# EAGLE design nanopositioner (EAGLE 9.6.2)

## Sheet 1 of 2
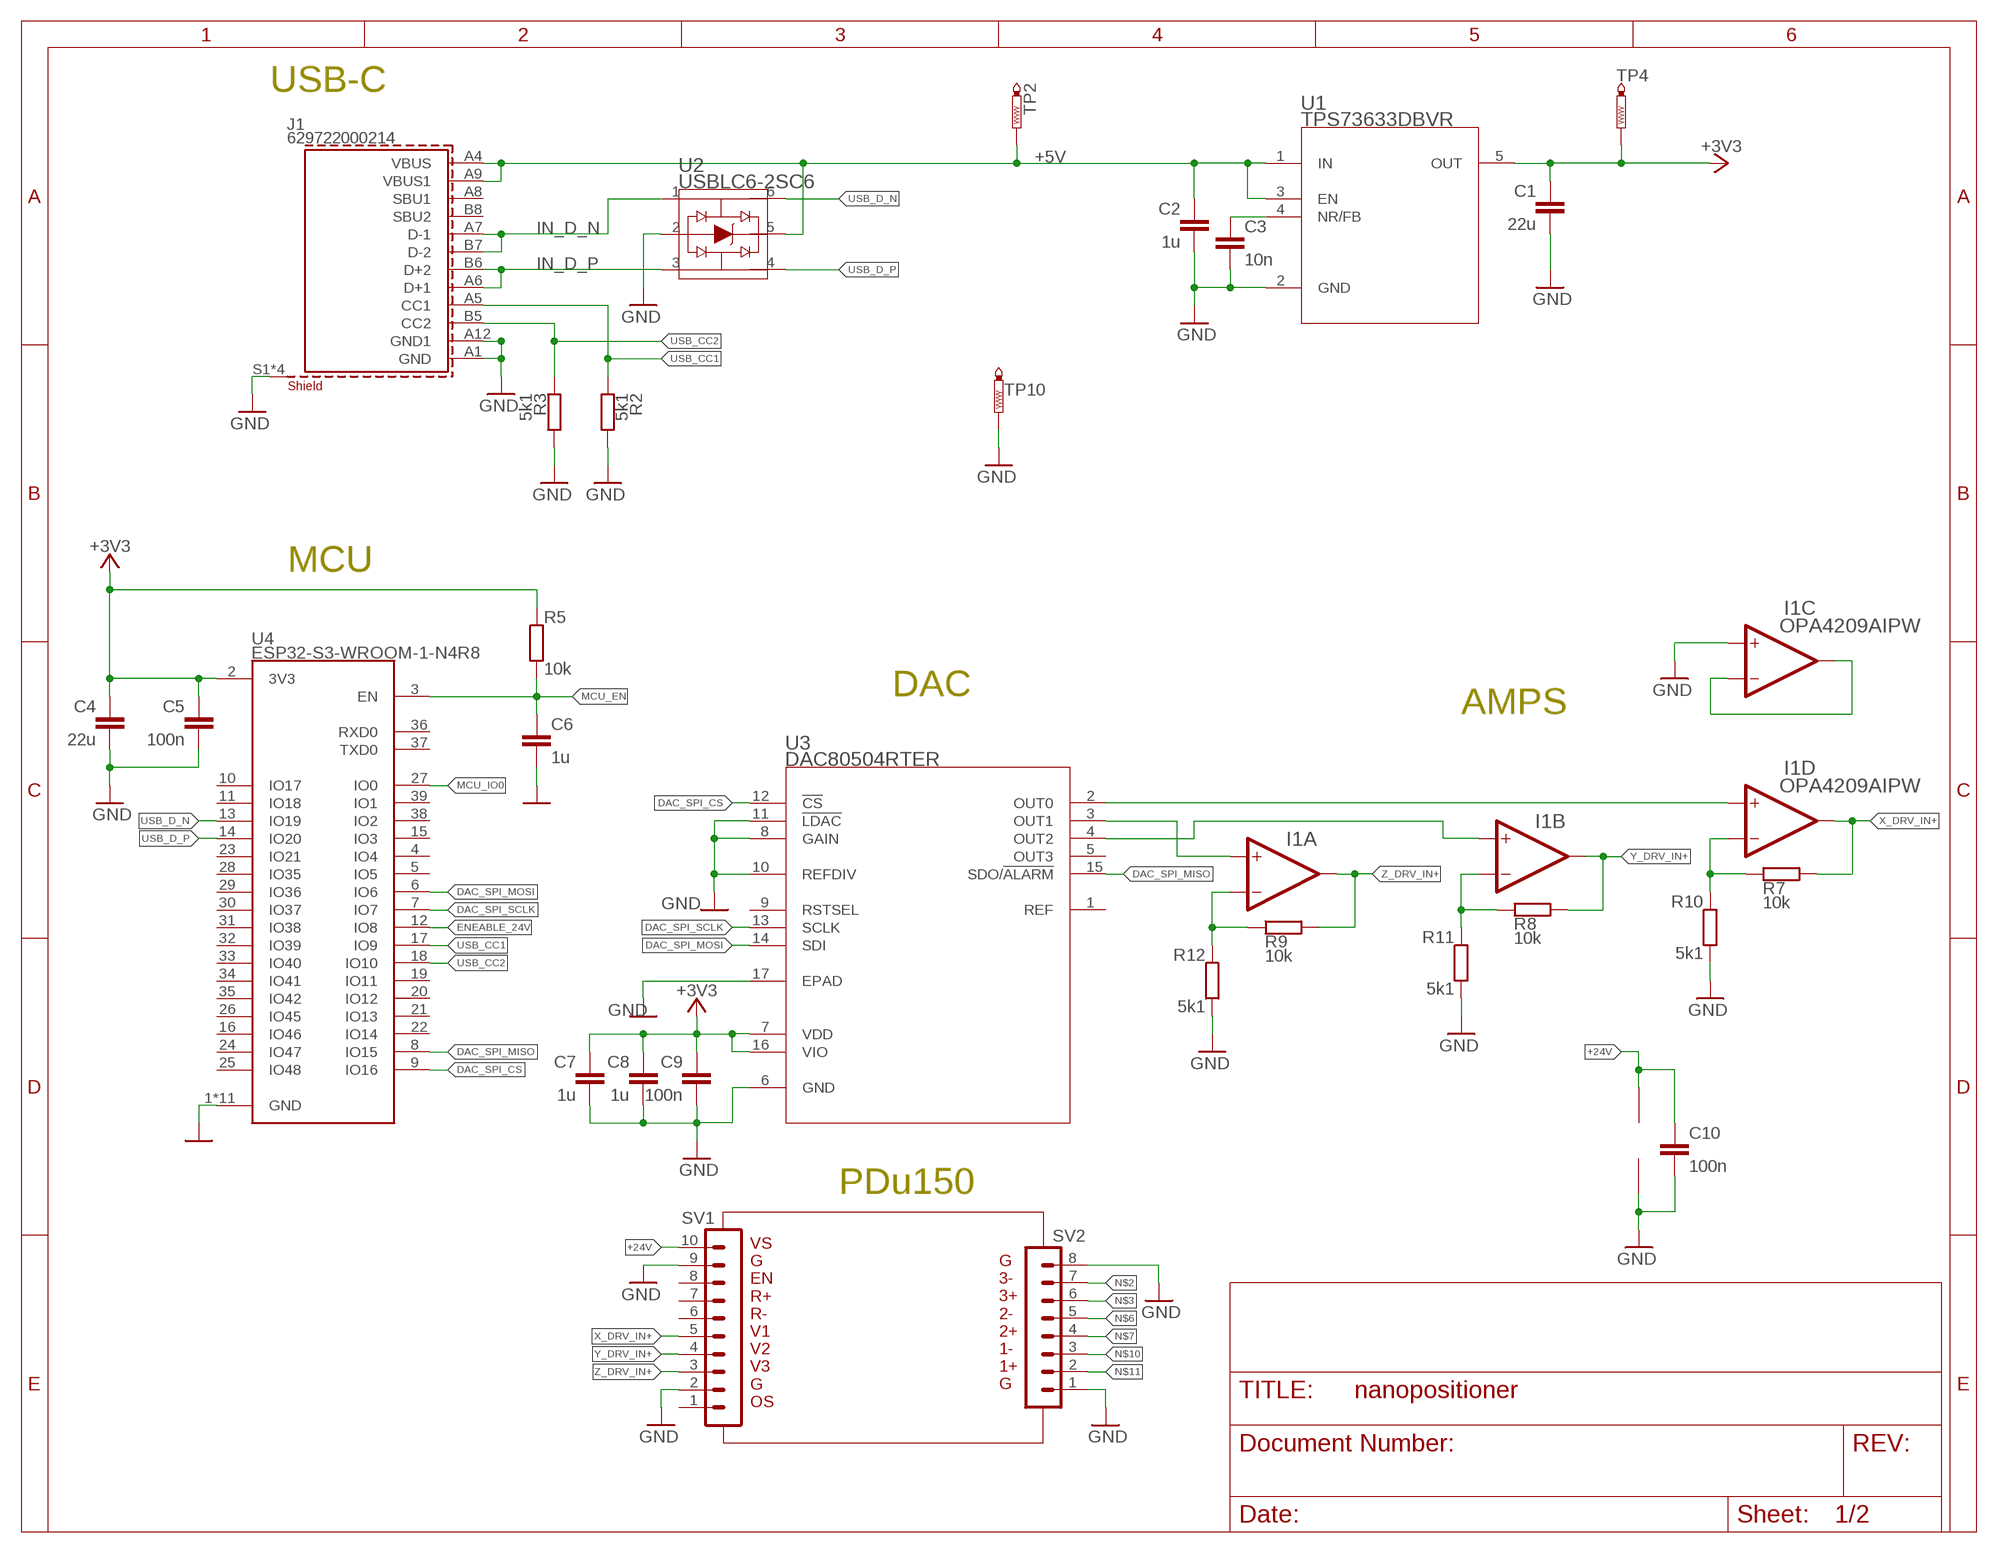
[diagram p0: schematic, sheet 1]

### Parts
C1  22u  C-EUC0603  [C0603]
C2  1u  C-EUC0402  [C0402]
C3  10n  C-EUC0402  [C0402]
C4  22u  C-EUC0603  [C0603]
C5  100n  C-EUC0402  [C0402]
C6  1u  C-EUC0402  [C0402]
C7  1u  C-EUC0402  [C0402]
C8  1u  C-EUC0402  [C0402]
C9  100n  C-EUC0402  [C0402]
C10  100n  C-EUC0402  [C0402]
I1  OPA4209AIPW  [PW14]
J1  629722000214  [629722000214]
R2  5k1  R-EU_R0402  [R0402]
R3  5k1  R-EU_R0402  [R0402]
R5  10k  R-EU_R0402  [R0402]
R7  10k  R-EU_R0402  [R0402]
R8  10k  R-EU_R0402  [R0402]
R9  10k  R-EU_R0402  [R0402]
R10  5k1  R-EU_R0402  [R0402]
R11  5k1  R-EU_R0402  [R0402]
R12  5k1  R-EU_R0402  [R0402]
SV1  MA10-1  [MA10-1]
SV2  MA08-1  [MA08-1]
TP2  PTR1PAD1-13  [P1-13]
TP4  PTR1PAD1-13  [P1-13]
TP10  PTR1PAD1-13  [P1-13]
U1  TPS73633DBVR  [DBV5]
U2  USBLC6-2SC6  [SOT23-6L_STM]
U3  DAC80504RTER  [RTE16_TEX]
U4  ESP32-S3-WROOM-1-N4R8  [XCVR_ESP32S3WROOM1N8R8]

### Nets
+3V3: C1.1 C4.1 C5.1 C7.1 C8.1 C9.1 R5.1 TP4.TP U1.5(OUT) U3.7(VDD) U3.16(VIO) U4.2(3V3)
+5V: C2.2 J1.A4(VBUS) J1.A9(VBUS1) TP2.TP U1.1(IN) U1.3(EN) U2.5 ; also sheet 2
+24V: C10.1 I1.4 SV1.10 ; also sheet 2
DAC_SPI_CS: U3.12(!CS) U4.9(IO16)
DAC_SPI_MISO: U3.15(SDO/!ALARM) U4.8(IO15)
DAC_SPI_MOSI: U3.14(SDI) U4.6(IO6)
DAC_SPI_SCLK: U3.13(SCLK) U4.7(IO7)
ENEABLE_24V: U4.12(IO8) ; also sheet 2
GND: C1.2 C2.1 C3.2 C4.2 C5.2 C6.1 C7.2 C8.2 C9.2 C10.2 I1.10(C:INA+) I1.11 J1.A1(GND) J1.A12(GND1) J1.S1(SHIELD) J1.S2(SHIELD) J1.S3(SHIELD) J1.S4(SHIELD) R2.1 R3.2 R10.2 R11.2 R12.2 SV1.2 SV1.9 SV2.1 SV2.8 TP10.TP U1.2(GND) U2.2 U3.6(GND) U3.8(GAIN) U3.10(REFDIV) U3.11(!LDAC) U3.17(EPAD) U4.1(GND) U4.40(GND) U4.41_1(GND) U4.41_2(GND) U4.41_3(GND) U4.41_4(GND) U4.41_5(GND) U4.41_6(GND) U4.41_7(GND) U4.41_8(GND) U4.41_9(GND) ; also sheet 2
IN_D_N [Diff pair]: J1.A7(D-1) J1.B7(D-2) U2.1
IN_D_P [Diff pair]: J1.A6(D+1) J1.B6(D+2) U2.3
MCU_EN: C6.2 R5.2 U4.3(EN)
MCU_IO0: U4.27(IO0)
N$1: I1.13(D:INA-) R7.1 R10.1
N$2: SV2.7
N$3: SV2.6
N$6: SV2.5
N$7: SV2.4
N$9: C3.1 U1.4(NR/FB)
N$10: SV2.3
N$11: SV2.2
N$12: I1.3(A:INA+) U3.3(OUT1)
N$13: I1.6(B:INA-) R8.1 R11.1
N$14: I1.5(B:INA+) U3.4(OUT2)
N$15: I1.2(A:INA-) R9.1 R12.1
N$16: I1.12(D:INA+) U3.2(OUT0)
N$17: I1.8(C:OUTA) I1.9(C:INA-)
USB_CC1: J1.A5(CC1) R2.2 U4.17(IO9)
USB_CC2: J1.B5(CC2) R3.1 U4.18(IO10)
USB_D_N [Diff pair]: U2.6 U4.13(IO19)
USB_D_P [Diff pair]: U2.4 U4.14(IO20)
X_DRV_IN+: I1.14(D:OUTA) R7.2 SV1.5
Y_DRV_IN+: I1.7(B:OUTA) R8.2 SV1.4
Z_DRV_IN+: I1.1(A:OUTA) R9.2 SV1.3
Unconnected: J1.A8(SBU1) J1.B8(SBU2) SV1.1 SV1.6 SV1.7 SV1.8 U3.1(REF) U3.5(OUT3) U3.9(RSTSEL) U4.4(IO4) U4.5(IO5) U4.10(IO17) U4.11(IO18) U4.15(IO3) U4.16(IO46) U4.19(IO11) U4.20(IO12) U4.21(IO13) U4.22(IO14) U4.23(IO21) U4.24(IO47) U4.25(IO48) U4.26(IO45) U4.28(IO35) U4.29(IO36) U4.30(IO37) U4.31(IO38) U4.32(IO39) U4.33(IO40) U4.34(IO41) U4.35(IO42) U4.36(RXD0) U4.37(TXD0) U4.38(IO2) U4.39(IO1)

### Notes on the sheet
- USB-C
- MCU
- DAC
- AMPS
- PDu150
- G
  3-
  3+
  2-
  2+
  1-
  1+
  G
- VS
  G
  EN
  R+
  R-
  V1
  V2
  V3
  G
  OS

## Sheet 2 of 2
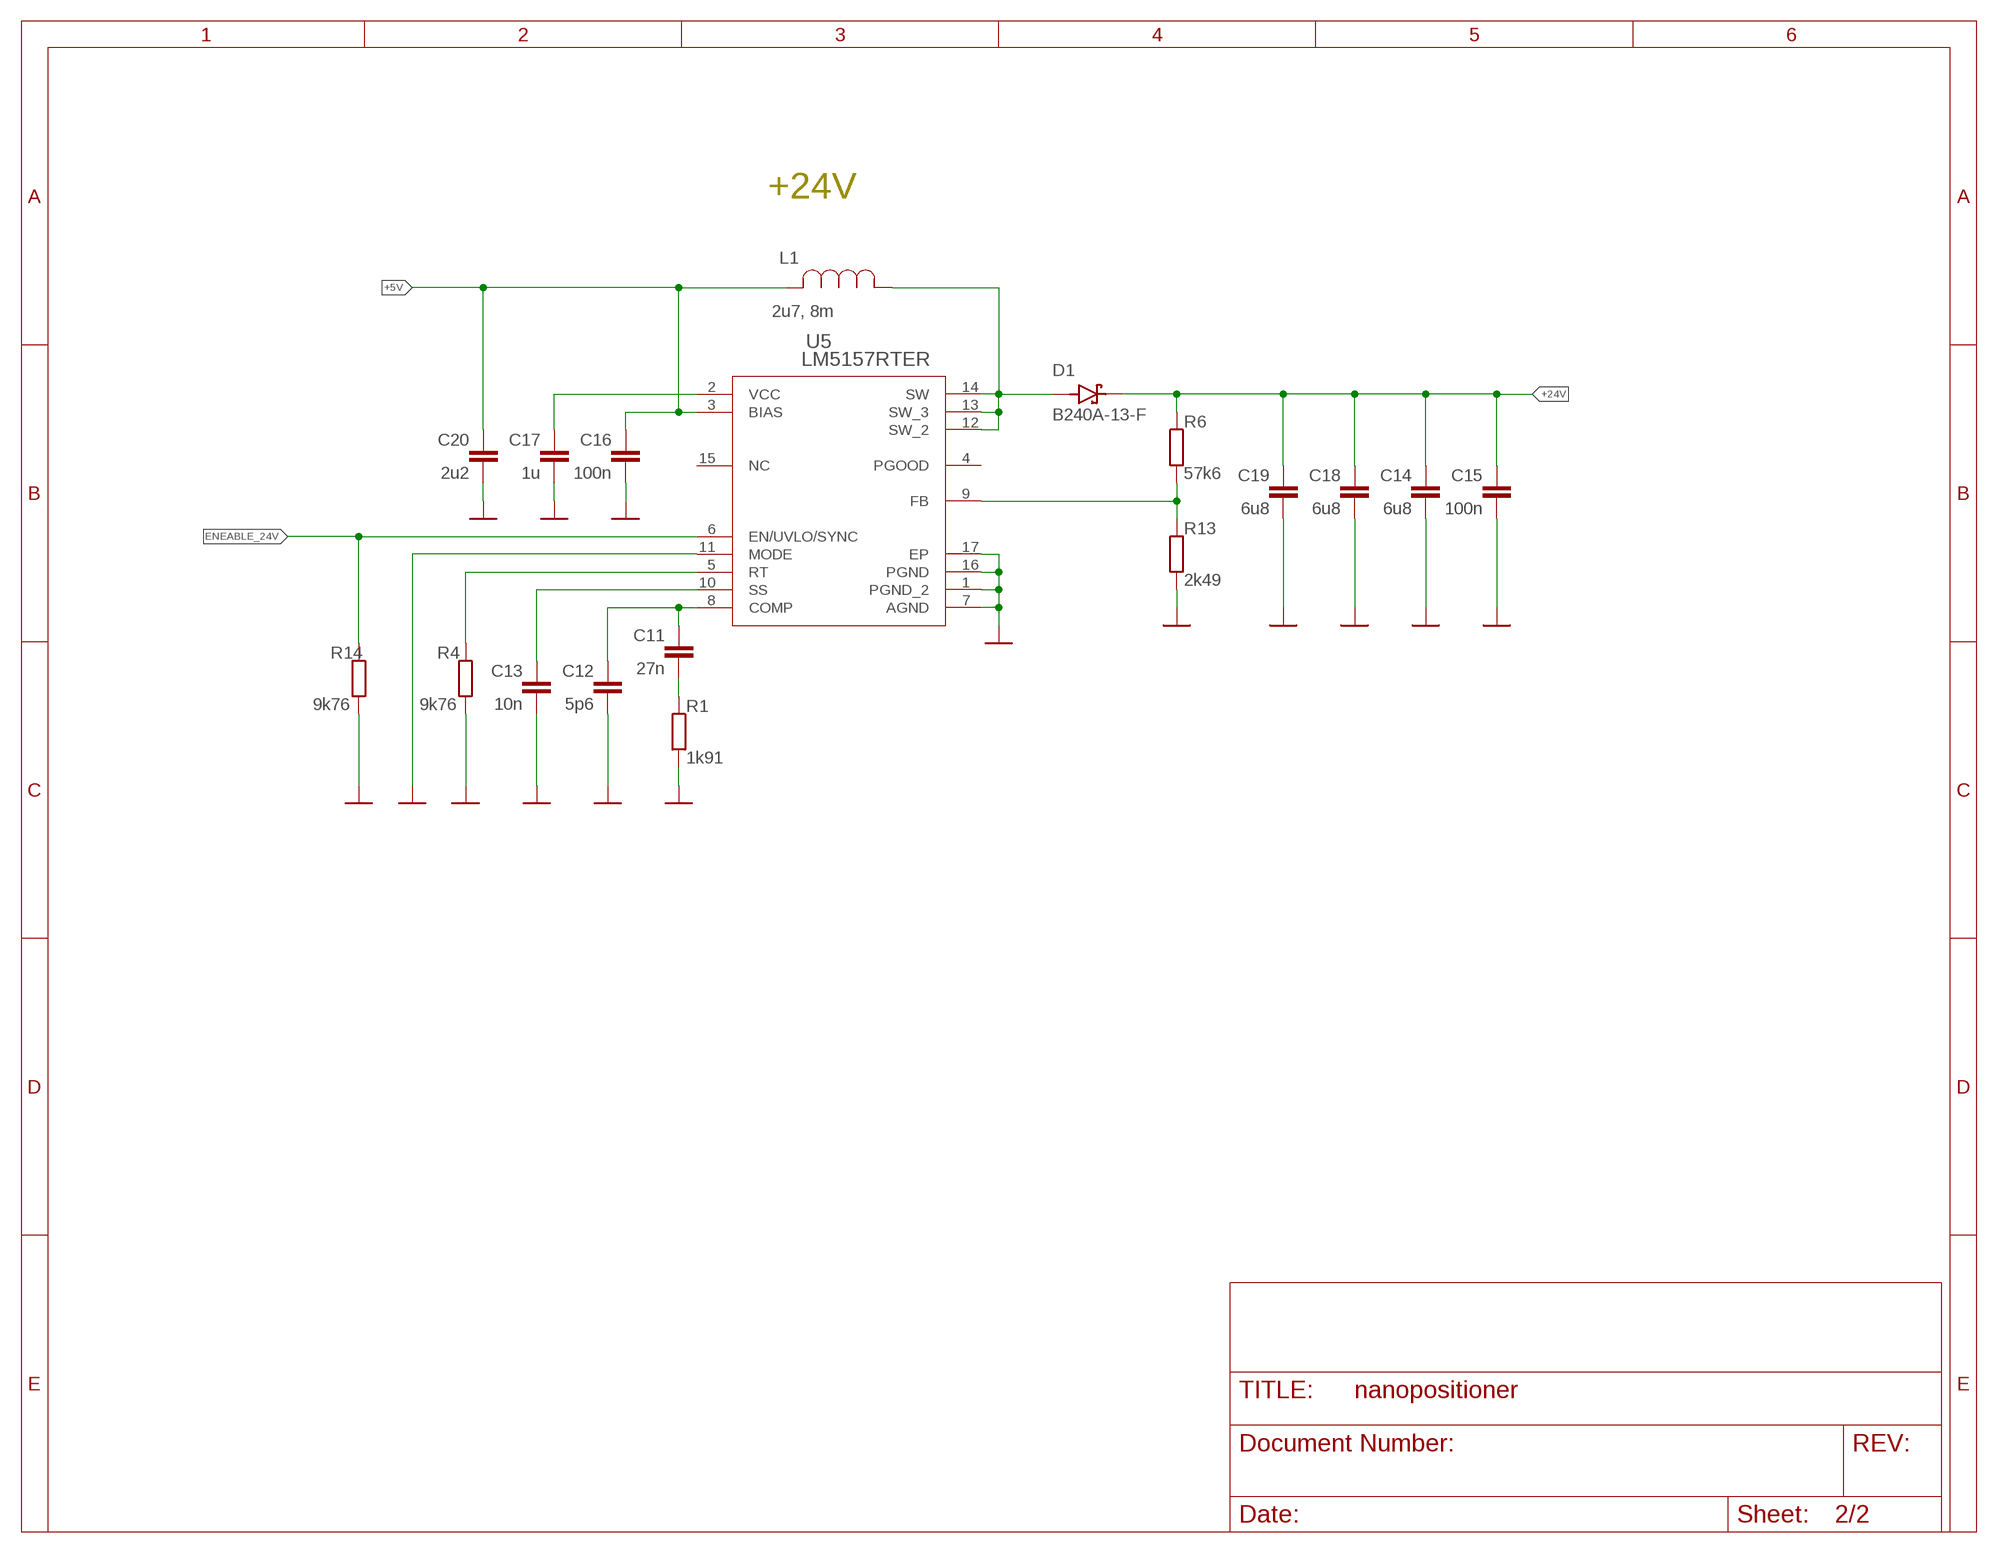
[diagram p1: schematic, sheet 2]

### Parts
C11  27n  C-EUC0402  [C0402]
C12  5p6  C-EUC0402  [C0402]
C13  10n  C-EUC0402  [C0402]
C14  6u8  C-EUC1206  [C1206]
C15  100n  C-EUC0603  [C0603]
C16  100n  C-EUC0603  [C0603]
C17  1u  C-EUC0402  [C0402]
C18  6u8  C-EUC1206  [C1206]
C19  6u8  C-EUC1206  [C1206]
C20  2u2  C-EUC0805  [C0805]
D1  B240A-13-F  [DIOM5226X230N]
L1  2u7, 8m  SDR1307-2R7ML  [IND_BOURNS_SDR1307]
R1  1k91  R-EU_R0402  [R0402]
R4  9k76  R-EU_R0402  [R0402]
R6  57k6  R-EU_R0402  [R0402]
R13  2k49  R-EU_R0402  [R0402]
R14  9k76  R-EU_R0402  [R0402]
U5  LM5157RTER  [QFN_57RTER_TEX]

### Nets
+5V: C16.2 C20.2 L1.2 U5.3(BIAS) ; also sheet 1
+24V: C14.2 C15.2 C18.2 C19.2 D1.C(K) R6.1 ; also sheet 1
ENEABLE_24V: R14.1 U5.6(EN/UVLO/SYNC) ; also sheet 1
GND: C12.1 C13.1 C14.1 C15.1 C16.1 C17.1 C18.1 C19.1 C20.1 R1.2 R4.2 R13.2 R14.2 U5.1(PGND_2) U5.7(AGND) U5.11(MODE) U5.16(PGND) U5.17(EP) ; also sheet 1
N$8: C11.2 C12.2 U5.8(COMP)
N$18: C11.1 R1.1
N$20: C13.2 U5.10(SS)
N$21: R4.1 U5.5(RT)
N$22: D1.A L1.1 U5.12(SW_2) U5.13(SW_3) U5.14(SW)
N$23: R6.2 R13.1 U5.9(FB)
N$26: C17.2 U5.2(VCC)
Unconnected: U5.15(NC)

### Notes on the sheet
- +24V

## Power pins joined to a net without a drawn wire
PGOOD: U5.4(PGOOD)

## Library data of the parts
C1 C4 = rcl:C-EU: CAPACITOR, European symbol; MPN: CL10A226MP8NUNE; SPICEPREFIX: C
C2 C6-C8 = rcl:C-EU: CAPACITOR, European symbol; MPN: GRM155R61E105MA12D; SPICEPREFIX: C
C3 = rcl:C-EU: CAPACITOR, European symbol; MPN: GCM155R71H103KA55D; SPICEPREFIX: C
C5 C9 C10 = rcl:C-EU: CAPACITOR, European symbol; MPN: GRM155R71H104KE14D; SPICEPREFIX: C
C11 = rcl:C-EU: CAPACITOR, European symbol; MPN: GRM155R71A273KA01D; SPICEPREFIX: C
C12 = rcl:C-EU: CAPACITOR, European symbol; MPN: GRM1555C1H5R6CA01D; SPICEPREFIX: C
C13 = rcl:C-EU: CAPACITOR, European symbol; MPN: GRM033R70J103KA01D; SPICEPREFIX: C
C14 C18 C19 = rcl:C-EU: CAPACITOR, European symbol; MPN: C3216X5R1H685K160AB; SPICEPREFIX: C
C15 = rcl:C-EU: CAPACITOR, European symbol; MPN: CGA3E2X7R1H104K080AA; SPICEPREFIX: C
C16 = rcl:C-EU: CAPACITOR, European symbol; MPN: KGM21NR71E104KT; SPICEPREFIX: C
C17 = rcl:C-EU: CAPACITOR, European symbol; MPN: EMK107B7105KA-T; SPICEPREFIX: C
C20 = rcl:C-EU: CAPACITOR, European symbol; MPN: GRM21BR71A225KA01L; SPICEPREFIX: C
D1 = B240A-13-F:B240A-13-F: Diode Schottky 40V 2A Surface Mount SMA; MANUFACTURER: Diodes; MAXIMUM_PACKAGE_HEIGHT: 2.3 mm; MPN: B240A-13-F; PARTREV: 22 - 2; STANDARD: IPC-7351B
I1 = askjd askdjhaskd:OPA4209AIPW; COPYRIGHT: Copyright (C) 2024 Ultra Librarian. All rights reserved.; MANUFACTURER_PART_NUMBER: OPA4209AIPW; MFR_NAME: Texas Instruments; MPN: OPA4209AIPW; SPICEPREFIX: J
J1 = Eagle_WR-USB (rev22c):629722000214: WR-COM USB 2.0 Type C Plug Vertical SMT Kind Properties Durability 10 000 Mating cycles Gender Receptacle Type Horizontal General Information Operating Temperature -40 up to +85 °C Electrical Properties Working Voltage 20 V (DC) Withstanding Voltage 100 V (AC) Contact Resistance 40 mΩ Material Properties Insulator Material LCP Insulator Flammability Rating UL94 V-0 Insulator Color Black Contact Material Brass Contact Plating Gold over Nickel Contact Type Stamped Shielding Material Steel Shielding Plating Nickel (Ni) <https://www.we-online.com/catalog/media/o689297v209%20family-wr-com-629722000214.jpg> Details see: www.we-online.com/catalog/WR-COM_USB_20_TYPE_C_RECEPTACLE_HORIZONTAL_SMT <www.we-online.com/catalog/WR-COM_USB_20_TYPE_C_RECEPTACLE_HORIZONTAL_SMT/?utm_source=eagle_model&utm_medium=description_link&utm_campaign=eisos_eagle> Updated by Ella Wu 2022-11-15 2022 (C) Würth Elektronik; APPLICATION: USB 2.0; DATASHEET-URL: https://www.we-online.com/redexpert/spec/629722000214?ae; GERDER: Receptacle; INTERFACE-TYPE: Type C; IR: 5A; MOUNT: SMT; MPN: 12402012E212A; PACKAGING: Tape and Reel; PART-NUMBER: 629722000214; PINS: 16; TYPE: Horizontal; WORKING-VOLTAGE: 20V(AC)
L1 = askjdnsadbka:SDR1307-2R7ML; MPN: SDR1307-2R7ML
R1 = rcl:R-EU_: RESISTOR, European symbol; MPN: CRCW04021K91FKED; SPICEPREFIX: R
R2 R3 R10-R12 = rcl:R-EU_: RESISTOR, European symbol; MPN: ERA-2AEB512X; SPICEPREFIX: R
R4 R14 = rcl:R-EU_: RESISTOR, European symbol; MPN: CRCW04029K76FKED; SPICEPREFIX: R
R5 R7-R9 = rcl:R-EU_: RESISTOR, European symbol; MPN: ERA-2AEB103X; SPICEPREFIX: R
R6 = rcl:R-EU_: RESISTOR, European symbol; MPN: CRCW040257K6FKED; SPICEPREFIX: R
R13 = rcl:R-EU_: RESISTOR, European symbol; MPN: CRCW04022K49FKED; SPICEPREFIX: R
SV1 = con-lstb:MA10-1: PIN HEADER; OC_FARNELL: unknown; OC_NEWARK: unknown
SV2 = con-lstb:MA08-1: PIN HEADER; OC_FARNELL: unknown; OC_NEWARK: unknown
TP2 TP4 TP10 = testpad:PTR1: TEST PIN
U1 = untitled7:TPS73633DBVR; COPYRIGHT: Copyright (C) 2023 Ultra Librarian. All rights reserved.; MANUFACTURER_PART_NUMBER: TPS73601DBVR; MFR_NAME: Texas Instruments; MPN: TPS73633DBVR
U2 = untitled31241:USBLC6-2SC6; COPYRIGHT: Copyright (C) 2023 Ultra Librarian. All rights reserved.; MANUFACTURER_PART_NUMBER: USBLC6-2SC6; MFR_NAME: STMicroelectronics; MPN: USBLC6-2SC6
U3 = untitled23dwd2:DAC80504RTER; COPYRIGHT: Copyright (C) 2024 Ultra Librarian. All rights reserved.; MANUFACTURER_PART_NUMBER: DAC80504RTER; MFR_NAME: Texas Instruments; MPN: DAC80504RTET
U4 = ESP32-S3-WROOM-1-N4R8:ESP32-S3-WROOM-1-N4R8: Check availability <https://pricing.snapeda.com/parts/ESP32S3WROOM1N8R8/Espressif%20Systems/view-part?ref=eda> Check availability <https://pricing.snapeda.com/parts/ESP32-S3-WROOM-1-N8R8/Espressif%20Systems/view-part?ref=eda>; AVAILABILITY: In Stock; DESCRIPTION: Bluetooth, WiFi 802.11b/g/n, Bluetooth v5.0 Transceiver Module 2.4GHz PCB Trace Surface Mount; MF: Espressif Systems; MP: ESP32-S3-WROOM-1-N8R8; MPN: ESP32-S3-WROOM-1-N4; PACKAGE: None; PRICE: None; PURCHASE-URL: https://pricing.snapeda.com/search?q=ESP32-S3-WROOM-1-N8R8&ref=eda
U5 = dkjdaksndkja:LM5157RTER; COPYRIGHT: Copyright (C) 2024 Ultra Librarian. All rights reserved.; MANUFACTURER_PART_NUMBER: LM5157RTER; MFR_NAME: Texas Instruments; MPN: LM5157RTER

## Net classes
2 Diff pair: width 0.158 mm, clearance 0.203 mm

## Board
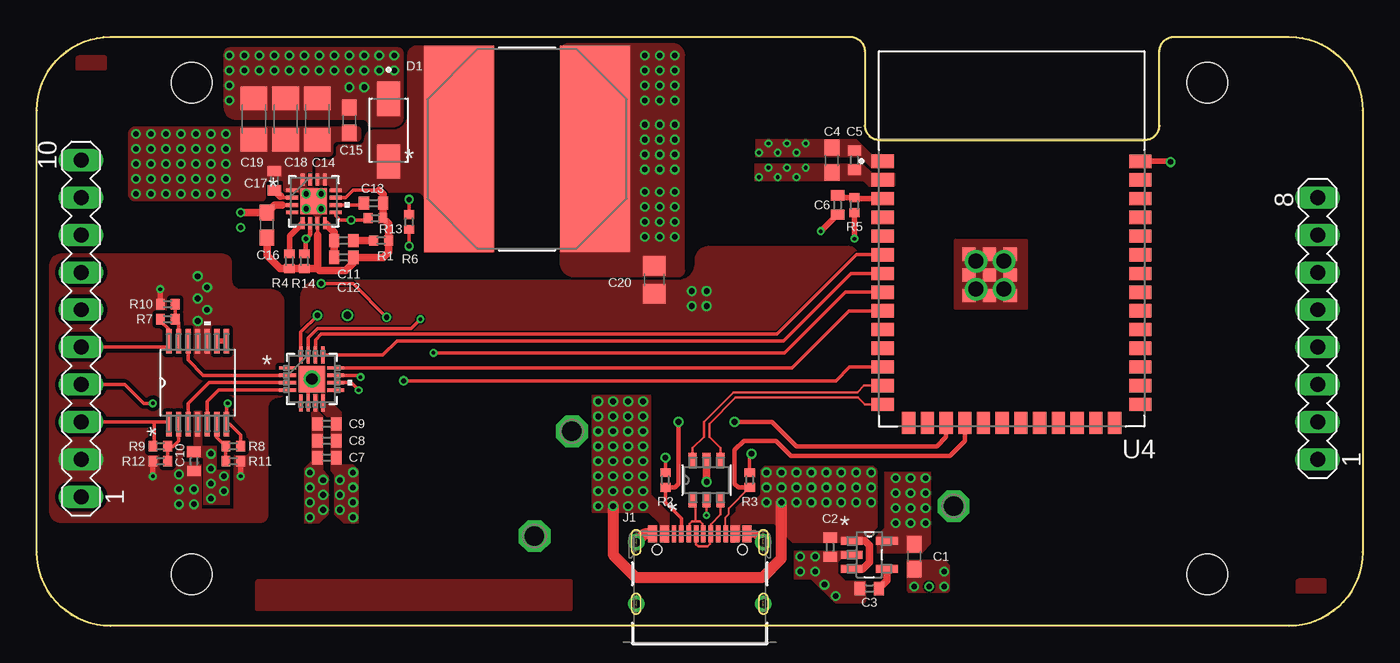
[diagram p2: board, top side]
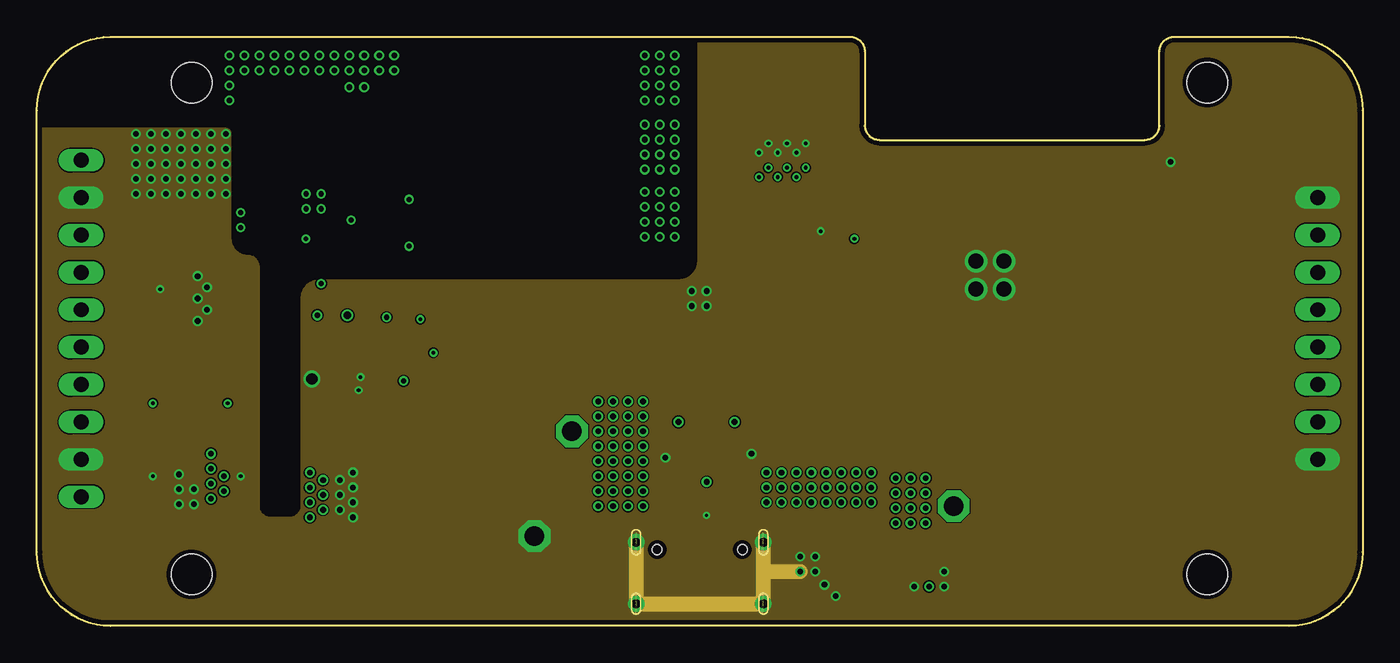
[diagram p3: board, inner layer Route2]
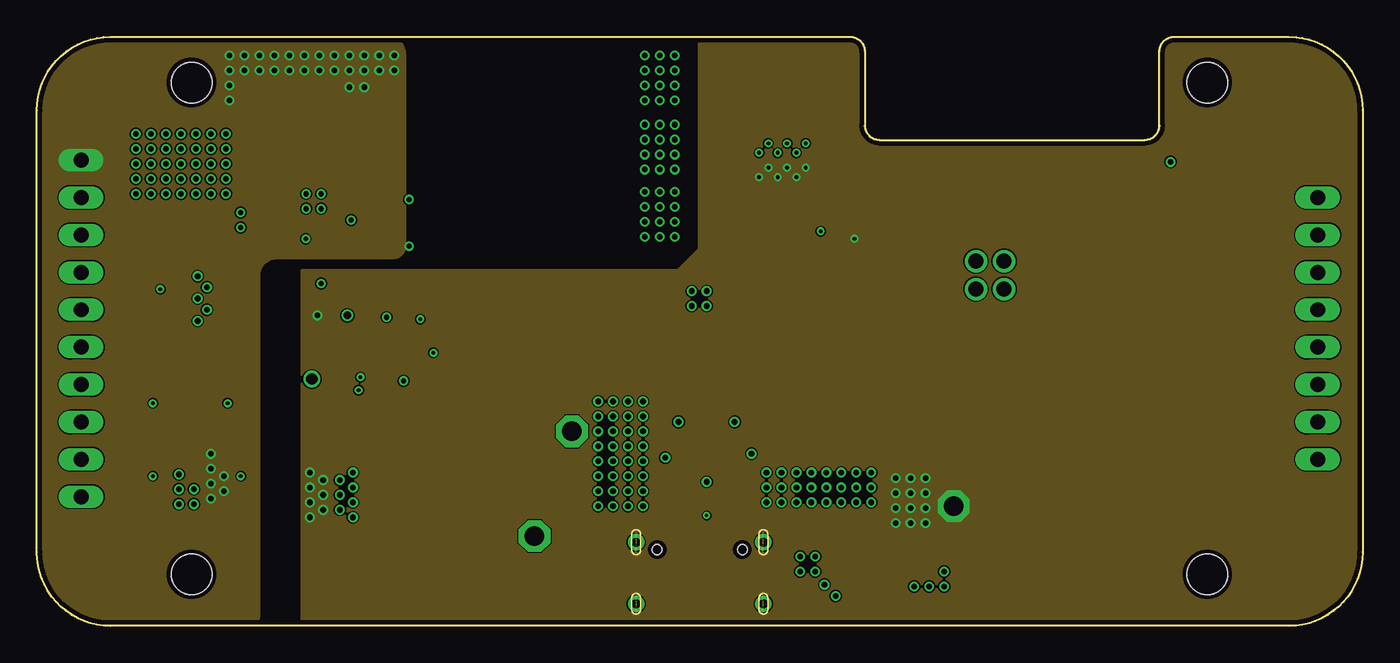
[diagram p4: board, inner layer Route15]
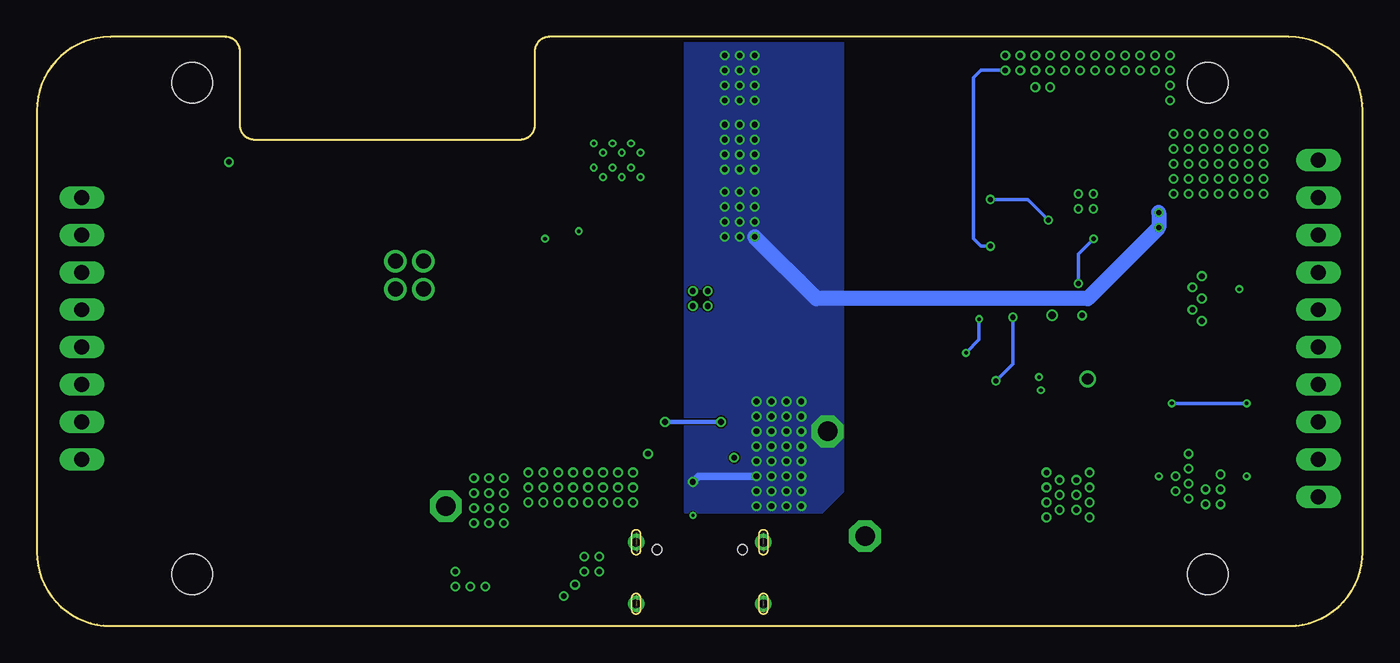
[diagram p5: board, bottom side, seen from below]

Size 90 x 40 mm. Coordinates in mm from the lower left corner, seen from the top.
Outline: 5,0 arc-90 0,5 0,35 arc-90 5,40 55.21,40 arc-90 56.21,39 56.21,34 arc90 57.21,33 75.21,33 arc90 76.21,34 76.21,39 arc-90 77.21,40 85,40 arc-90 90,35 90,5 arc-90 85,0 5,0
Copper layers (1+2*15+16): Top 0.035mm / dielectric 0.0994mm / Route2 0.0152mm / dielectric 1.265mm / Route15 0.0152mm / dielectric 0.0994mm / Bottom 0.035mm
Design rules "JLCPCB_JLC04161H-3313": minimum track width 0.09mm, minimum drill 0.2mm, track to track 0.09mm, track to pad 0.2mm, pad to pad 0.2mm, via to via 0.2mm, smd to smd 0.2mm, copper to edge 0.3mm, drill to drill 10mil, minimum pad ring 10mil, minimum via ring 0.14mm, stop-mask expansion 1mil, vias tented up to drill 0mil, thermal gap 10mil
Holes 2.75 mm at 10.5,3.5 79.45,3.5 10.5,36.89 79.45,36.89

### Footprints (pad centres in the part's own frame; a part is rotated, then mirrored left to right if it is on the bottom)
C0603 = smd 1.1 x 1: 1 -0.85,0; 2 0.85,0
C0402 = smd 0.7 x 0.9: 1 -0.65,0; 2 0.65,0
C1206 = smd 1.6 x 1.8: 1 -1.4,0; 2 1.4,0
C0805 = smd 1.3 x 1.5: 1 -0.95,0; 2 0.95,0
DIOM5226X230N = smd 2.33 x 1.55: A 2.135,0; C -2.135,0
PW14 = smd 1.676 x 0.356: 1 -2.819,1.95; 2 -2.819,1.3; 3 -2.819,0.65; 4 -2.819,0; 5 -2.819,-0.65; 6 -2.819,-1.3; 7 -2.819,-1.95; 8 2.819,-1.95; 9 2.819,-1.3; 10 2.819,-0.65; 11 2.819,0; 12 2.819,0.65; 13 2.819,1.3; 14 2.819,1.95
629722000214 = smd 0.6 x 1.15: A1 -3.2,4.745; A4 -2.4,4.745; A9 2.4,4.745; A12 3.2,4.745 | smd 0.3 x 1.15: A5 -1.25,4.745; A6 -0.25,4.745; A7 0.25,4.745; A8 1.25,4.745; B5 1.75,4.745; B6 0.75,4.745; B7 -0.75,4.745; B8 -1.75,4.745 | drill 0.6 pad 1: S1 -4.32,4.18; S2 4.32,4.18; S3 -4.32,0; S4 4.32,0 | hole 0.65: -2.89,3.68; 2.89,3.68
IND_BOURNS_SDR1307 = smd 4.75 x 13.995: 1 -4.623,0; 2 4.623,0
R0402 = smd 0.6 x 0.7: 1 -0.5,0; 2 0.5,0
MA10-1 = drill 1.016 long: 1 -11.43,0; 2 -8.89,0; 3 -6.35,0; 4 -3.81,0; 5 -1.27,0; 6 1.27,0; 7 3.81,0; 8 6.35,0; 9 8.89,0; 10 11.43,0
MA08-1 = drill 1.016 long: 1 -8.89,0; 2 -6.35,0; 3 -3.81,0; 4 -1.27,0; 5 1.27,0; 6 3.81,0; 7 6.35,0; 8 8.89,0
P1-13 = drill 1.321 pad 2.159 octagon: TP 0,0
DBV5 = smd 1.473 x 0.559: 1 -1.194,0.95; 2 -1.194,0; 3 -1.194,-0.95; 4 1.194,-0.95; 5 1.194,0.95
SOT23-6L_STM = smd 0.978 x 0.559: 1 -1.365,0.95; 2 -1.365,0; 3 -1.365,-0.95; 4 1.365,-0.95; 5 1.365,0; 6 1.365,0.95
RTE16_TEX = smd 1.155 x 0.229: 1 -1.627,0.75; 2 -1.627,0.25; 3 -1.627,-0.25; 4 -1.627,-0.75; 9 1.627,-0.75; 10 1.627,-0.25; 11 1.627,0.25; 12 1.627,0.75 | smd 0.229 x 1.155: 5 -0.75,-1.627; 6 -0.25,-1.627; 7 0.25,-1.627; 8 0.75,-1.627; 13 0.75,1.627; 14 0.25,1.627; 15 -0.25,1.627; 16 -0.75,1.627 | smd 1.8 x 1.8: 17 0,0
XCVR_ESP32S3WROOM1N8R8 = smd 1.5 x 0.9: 1 -8.75,5.26; 2 -8.75,3.99; 3 -8.75,2.72; 4 -8.75,1.45; 5 -8.75,0.18; 6 -8.75,-1.09; 7 -8.75,-2.36; 8 -8.75,-3.63; 9 -8.75,-4.9; 10 -8.75,-6.17; 11 -8.75,-7.44; 12 -8.75,-8.71; 13 -8.75,-9.98; 14 -8.75,-11.25; 27 8.75,-11.25; 28 8.75,-9.98; 29 8.75,-8.71; 30 8.75,-7.44; 31 8.75,-6.17; 32 8.75,-4.9; 33 8.75,-3.63; 34 8.75,-2.36; 35 8.75,-1.09; 36 8.75,0.18; 37 8.75,1.45; 38 8.75,2.72; 39 8.75,3.99; 40 8.75,5.26 | smd 0.9 x 1.5: 15 -6.985,-12.5; 16 -5.715,-12.5; 17 -4.445,-12.5; 18 -3.175,-12.5; 19 -1.905,-12.5; 20 -0.635,-12.5; 21 0.635,-12.5; 22 1.905,-12.5; 23 3.175,-12.5; 24 4.445,-12.5; 25 5.715,-12.5; 26 6.985,-12.5 | smd 0.9 x 0.9: 41_1 -1.5,-2.46; 41_2 -2.9,-2.46; 41_3 -0.1,-2.46; 41_4 -2.9,-3.86; 41_5 -1.5,-3.86; 41_6 -0.1,-3.86; 41_7 -2.9,-1.06; 41_8 -1.5,-1.06; 41_9 -0.1,-1.06
QFN_57RTER_TEX = smd 0.813 x 0.254: 1 -1.473,0.75; 2 -1.473,0.25; 3 -1.473,-0.25; 4 -1.473,-0.75; 9 1.473,-0.75; 10 1.473,-0.25; 11 1.473,0.25; 12 1.473,0.75 | smd 0.254 x 0.813: 5 -0.75,-1.473; 6 -0.25,-1.473; 7 0.25,-1.473; 8 0.75,-1.473; 13 0.75,1.473; 14 0.25,1.473; 15 -0.25,1.473; 16 -0.75,1.473 | smd 1.753 x 1.753: 17 0,0

### Placement (x,y rotation side)
C1  59.56,4.7 270 top
C2  53.85,5.33 90 top
C3  56.52,2.54 180 top
C4  53.98,31.62 90 top
C5  55.5,31.62 90 top
C6  54.36,28.57 90 top
C7  19.68,11.43 0 top
C8  19.68,12.57 0 top
C9  19.68,13.72 0 top
C10  10.67,11.18 270 top
C11  20.83,26.16 180 top
C12  20.83,25.02 180 top
C13  22.86,28.7 180 top
C14  19.05,34.41 90 top
C15  21.21,34.33 90 top
C16  15.62,27.22 90 top
C17  16.13,30.23 270 top
C18  16.89,34.41 90 top
C19  14.73,34.41 90 top
C20  41.91,23.5 90 top
D1  23.88,33.66 270 top
I1  10.92,16.51 90 top
J1  45,1.5 0 top
L1  33.27,32.38 0 top
R1  23.37,26.16 0 top
R2  42.67,9.91 270 top
R3  48.39,9.91 90 top
R4  17.14,24.77 270 top
R5  55.5,28.57 90 top
R6  25.27,27.43 90 top
R7  8.89,20.83 180 top
R8  13.34,12.19 0 top
R9  8.38,12.19 180 top
R10  8.89,21.84 180 top
R11  13.34,11.18 0 top
R12  8.38,11.18 180 top
R13  22.99,27.69 0 top
R14  18.16,24.77 270 top
SV1  3,20.2 90 top
SV2  86.95,20.2 90 top
TP2  36.32,13.21 0 top
TP4  62.23,8.13 0 top
TP10  33.78,6.1 0 top
U1  56.52,4.83 0 top
U2  45.47,9.91 90 top
U3  18.67,16.76 0 top
U4  66.17,26.29 0 top
U5  18.8,28.83 0 top

### Tracks (layer width: path | path; a pad name or v marks a point on that pad's centre or on a via)
+3V3  (via drill 0.25, 0.38)
  Top 0.254: U3.16 17.92,19.95 v19.05,21.08
  Top 0.381: R5.1 v55.5,26.29
  other vias: 49.02,30.48 49.66,31.11 50.29,30.48 50.93,31.11 51.56,30.48 52.2,31.11 18.54,10.41 19.43,9.91 19.43,8.89 18.54,9.4 18.54,8.38 18.54,7.37 19.43,7.87 60.33,8 59.31,8 59.31,9.02 60.33,9.02 60.33,10.03 58.29,10.03 58.29,9.02 58.29,8 58.29,6.99 59.31,6.99 60.33,6.99 59.31,10.03
  pour Top (no thermals): 48.77,31.37 56.01,31.37 56.64,30.73 58.17,30.73 58.17,29.84 56.52,29.84 56.13,30.23 48.77,30.23
  pour Top (no thermals): 18.67,14.22 18.67,11.18 18.16,10.67 18.16,6.99 19.18,6.99 19.81,7.62 19.81,10.16 19.43,10.54 19.43,14.22
  pour Top (no thermals): 18.8,15.75 19.05,15.75 19.05,14.61 19.43,14.22 18.67,14.22 18.67,14.48 18.8,14.61
  pour Top (no thermals): 57.53,10.41 57.53,6.6 57.02,6.1 57.02,4.95 60.07,4.95 60.71,5.59 60.71,10.41
  pour Route15 (no thermals): 18,0 90,0 90,40 44.98,40 44.98,25.59 43.52,24.13 18,24.13
+5V  (via drill 0.35, 0.38)
  Top 0.254: 16.65,28.58 U5.3
  Top 0.508: U1.1 56.2,5.78 56.52,5.46 56.52,4.32 56.07,3.88 U1.3 | U2.5 v45.47,9.78 | 16.65,28.58 16.13,28.58 C16.2 v13.84,28.07
  Top 0.762: v39.12,8.13 39.12,4.83 40.64,3.3 49.28,3.3 50.55,4.57 v50.55,8.38
  Bottom 0.508: v45.47,9.78 45.09,10.16 v41.15,10.16
  Bottom 1.016: v13.84,28.07 v13.84,27.05 18.67,22.23 37.08,22.23 v41.27,26.42
  other vias: 39.12,11.18 40.13,11.18 41.15,11.18 40.13,10.16 39.12,10.16 39.12,9.14 40.13,8.13 41.15,8.13 41.15,9.14 40.13,9.14 41.27,29.46 42.29,29.46 43.31,28.45 42.29,28.45 41.27,28.45 41.27,27.43 42.29,26.42 43.31,26.42 43.31,27.43 42.29,27.43 43.31,29.46 38.1,10.16 38.1,11.18 38.1,12.19 39.12,12.19 40.13,12.19 41.15,12.19 39.12,14.22 40.13,14.22 41.15,14.22 38.1,13.21 38.1,14.22 38.1,15.24 39.12,13.21 40.13,13.21 41.15,13.21 39.12,15.24 40.13,15.24 41.15,15.24 38.1,8.13 38.1,9.14 54.61,8.38 55.63,8.38 56.64,8.38 54.61,9.4 55.63,9.4 56.64,9.4 54.61,10.41 55.63,10.41 56.64,10.41 53.59,8.38 53.59,9.4 53.59,10.41 50.55,10.41 51.56,10.41 52.58,10.41 50.55,9.4 51.56,9.4 52.58,9.4 51.56,8.38 52.58,8.38 49.53,8.38 49.53,9.4 49.53,10.41 41.27,34.04 42.29,34.04 43.31,33.02 42.29,33.02 41.27,33.02 41.27,32 41.27,30.99 42.29,30.99 43.31,30.99 43.31,32 42.29,32 43.31,34.04 41.27,38.73 42.29,38.73 43.31,37.72 42.29,37.72 41.27,37.72 41.27,36.7 41.27,35.69 42.29,35.69 43.31,35.69 43.31,36.7 42.29,36.7 43.31,38.73
  pour Top (no thermals): 37.72,7.75 41.53,7.75 42.29,6.99 42.29,5.71 42.93,5.71 42.93,7.62 41.66,8.89 41.66,15.62 37.72,15.62
  pour Bottom (no thermals): 45.97,39.88 35.31,39.88 35.31,9.14 36.7,7.75 45.97,7.75
  pour Top (no thermals): 47.12,5.71 47.75,5.71 47.75,6.99 50.04,6.99 51.31,5.71 56.01,5.71 57.02,6.73 57.02,10.54 56.77,10.79 49.4,10.79 49.15,10.54 49.15,8.89 48.9,8.64 48.13,8.64 47.5,8 47.5,7.75 47.12,7.37
  pour Top (no thermals): 36.07,39.5 arc90 35.56,38.99 35.56,24.64 arc90 36.45,23.75 43.56,23.75 arc90 43.94,24.13 43.94,38.73 arc90 43.18,39.5
+24V  (via drill 0.35, 0.38)
  Top 0.254: R6.1 v25.27,25.78
  Bottom 0.254: v25.27,25.78 25.91,25.78 26.42,26.29 26.42,37.21 25.91,37.72 v24.26,37.72
  other vias: 11.81,11.68 11.81,10.67 11.81,9.65 11.81,8.64 12.7,10.16 12.7,9.14 13.08,37.72 13.08,36.7 13.08,38.73 15.11,38.73 16.13,38.73 17.14,38.73 14.1,37.72 14.1,38.73 15.11,37.72 16.13,37.72 17.14,37.72 13.08,35.69 19.18,38.73 20.19,38.73 21.21,38.73 18.16,37.72 18.16,38.73 19.18,37.72 20.19,37.72 21.21,37.72 23.24,38.73 24.26,38.73 22.23,37.72 22.23,38.73 23.24,37.72 22.23,36.58 21.21,36.58
  pour Top (no thermals): 10.16,11.43 11.3,11.43 11.3,8.26 13.08,8.26 13.08,10.54 12.19,10.54 12.19,12.19 10.16,12.19
  pour Top (no thermals): 10.67,14.61 11.18,14.61 11.18,12.19 10.67,12.19
  pour Top (no thermals): 12.7,38.86 12.7,35.18 arc90 13.46,34.42 22.1,34.42 arc-90 22.48,34.04 arc90 22.61,33.91 24.26,33.91 arc90 24.89,34.54 24.89,38.86 arc90 24.51,39.24 13.08,39.24 arc90
  pour Route15 (no thermals): 15.11,0.64 arc-90 14.48,0 5.08,0 arc-90 0,5.08 0,32.51 0,34.92 arc-90 5.08,40.01 23.88,40.01 arc-90 25.02,38.86 25.02,25.78 arc-90 24.13,24.89 16.26,24.89 arc90 15.11,23.75
DAC_SPI_CS
  Top 0.254: U4.9 55.13,21.39 51.26,17.51 U3.12
DAC_SPI_MISO  (via drill 0.25)
  Top 0.254: U3.15 18.42,19.56 19.05,20.19 25.4,20.19 v26.04,20.83 | v26.92,18.54 50.76,18.54 54.88,22.66 U4.8
  Bottom 0.254: v26.92,18.54 26.04,19.43 v26.04,20.83
DAC_SPI_MOSI
  Top 0.254: U3.14 18.92,19.43 19.3,19.81 50.25,19.81 55.64,25.2 U4.6
DAC_SPI_SCLK
  Top 0.254: U3.13 23.48,18.39 24.45,19.36 50.69,19.36 55.26,23.93 U4.7
ENEABLE_24V  (via drill 0.3, 0.35)
  Top 0.254: U4.12 55.17,17.58 54.23,16.64 v24.89,16.64 | v19.3,23.25 21.46,23.25 v23.75,20.95
  Top 0.305: U5.6 18.55,26.58 v18.25,26.28 18.25,25.36 R14.1
  Bottom 0.254: v24.89,16.64 23.75,17.78 v23.75,20.95 | v19.3,23.25 19.3,25.23 v18.25,26.28
GND  (via drill 0.2, 0.25, 0.35, 0.38, 0.76, 1.02)
  Top 0.09: U3.17 18.61,16.7
  Top 0.158: U2.2 v45.47,7.49
  Top 0.254: U3.11 21.59,17.01 21.59,17.02 21.84,17.02 v21.97,16.89 | U3.10 21.33,16.51 v21.84,16 | R2.1 v42.67,11.43 | R3.2 48.39,11.56 v48.51,11.68 | U3.6 18.42,16.51 18.61,16.7 | U5.11 20.95,29.08 21.46,29.59 23.24,29.59 | 19.05,26.54 U5.7
  Top 0.381: C6.1 53.23,26.8 v53.21,26.8 | R12.2 7.87,11.17 v7.87,10.16 | R11.2 13.84,11.17 v13.84,10.16 | R10.2 8.38,21.85 v8.38,22.86 | U4.40 76.91,31.55 v76.96,31.5
  Top 0.508: J1.A1 41.63,6.25 | J1.S2 48.76,6.25 J1.A12 | 23.24,29.59 23.51,29.32 C13.1 23.51,27.71 R13.2 23.87,27.3 R1.2 23.87,25.39 23.5,25.02 C12.1 21.48,24.62 20.97,24.11 19.19,24.11 19.05,24.26 19.05,24.27 | 19.05,26.54 19.05,24.77 19.05,24.27 | 19.05,24.27 R14.2 R4.2 16.5,24.27 15.62,25.15 C16.1
  Top 0.762: 41.63,6.25 41.24,6.25 J1.S1
  Route2 1.016: J1.S1 J1.S3 J1.S4 49.32,3.68 | 49.32,3.68 J1.S2 | v51.82,3.68 49.32,3.68
  other vias: 49.66,32.77 49.02,32.13 50.29,32.13 50.93,32.77 51.56,32.13 52.2,32.77 10.67,9.27 10.67,8.26 9.65,8.26 9.65,9.27 9.65,10.29 10.92,23.75 10.92,20.7 11.56,21.46 10.92,22.23 11.56,22.99 18.67,16.76 20.57,9.91 21.46,10.41 21.46,9.4 21.46,8.38 20.57,8.89 20.57,7.87 21.46,7.37 51.82,4.7 52.83,4.7 52.83,3.68 53.47,2.79 54.23,2.03 61.59,3.68 61.59,2.67 59.56,2.67 63.75,24.77 65.66,24.77 65.66,22.86 63.75,22.86 19.3,29.34 19.3,28.32 18.29,28.32 18.29,29.34 6.73,32.38 6.73,33.4 8.76,33.4 9.78,33.4 10.79,33.4 7.75,32.38 7.75,33.4 8.76,32.38 9.78,32.38 10.79,32.38 6.73,31.37 7.75,31.37 6.73,30.35 7.75,30.35 8.76,30.35 8.76,31.37 10.79,31.37 11.81,31.37 12.83,31.37 9.78,30.35 9.78,31.37 10.79,30.35 11.81,30.35 12.83,30.35 8.76,29.34 10.79,29.34 11.81,29.34 12.83,29.34 9.78,29.34 6.73,29.34 7.75,29.34 44.45,22.73 44.45,21.72 45.47,21.72 45.47,22.73 11.81,33.4 12.83,33.4 11.81,32.38 12.83,32.38
  pour Top (no thermals): 48.77,31.88 55.88,31.88 56.64,31.11 58.17,31.11 58.17,32 56.64,32 55.63,33.02 48.77,33.02
  pour Top (no thermals): 11.81,24.13 11.81,18.41 10.67,18.41 10.67,24.13
  pour Top (no thermals): 10.41,10.92 9.65,10.92 9.27,10.54 9.27,10.41 9.27,7.87 11.05,7.87 11.18,7.87 11.18,10.92
  pour Top (no thermals): 19.94,14.22 19.94,10.54 20.19,10.29 20.19,7.62 20.83,6.99 21.84,6.99 21.84,10.54 21.46,10.92 20.7,10.92 20.7,14.22
  pour Top (no thermals): 19.3,14.61 19.68,14.22 19.94,14.22 20.7,14.22 20.7,14.48 20.19,14.99 19.68,14.99 19.56,15.11 19.56,15.75 19.3,15.75
  pour Top (no thermals): 54.61,5.08 56.01,5.08 56.01,4.57 54.61,4.57 54.36,4.32 54.36,4.19 54.36,3.68 54.36,3.56 54.61,3.3 54.86,3.05 55.24,3.05 56.26,3.05 56.26,1.91 56.26,1.78 56.26,1.65 56.13,1.52 54.23,1.52 52.58,3.17 51.44,3.17 51.44,5.08
  pour Top (no thermals): 59.05,4.45 59.05,2.41 59.18,2.29 61.85,2.29 61.98,2.41 61.98,4.06 61.59,4.45
  pour Top (no thermals): 62.36,26.16 62.36,21.59 67.18,21.59 67.18,26.16
  pour Top (no thermals): 41.4,23.24 arc90 41.15,22.99 41.15,21.59 arc90 41.4,21.34 45.59,21.34 arc90 45.85,21.59 45.85,22.99 arc90 45.59,23.24
  pour Top (no thermals): 19.18,27.69 19.18,27.18 18.92,27.18 18.92,27.69 arc90 18.67,27.94 17.91,27.94 17.91,29.21 arc90 17.65,29.46 16.89,29.46 arc-90 16.76,29.59 16.76,30.1 arc90 16.64,30.23 15.75,30.23 arc90 15.49,29.97 15.49,29.08 arc-90 15.24,28.83 6.73,28.83 arc-90 6.22,29.34 6.22,33.4 arc-90 6.73,33.91 21.72,33.91 arc-90 21.97,33.66 21.97,33.15 arc-90 21.72,32.89 20.45,32.89 arc90 20.07,32.51 20.07,32.13 arc-90 19.81,31.88 18.92,31.88 arc90 18.67,31.62 18.67,29.97 arc90 18.92,29.72 19.68,29.72 19.68,27.94 19.43,27.94 arc90
  pour Route2 (no thermals): 5.08,0 84.84,0 arc90 90.04,5.21 90.04,34.92 arc90 84.96,40.01 77.22,40.01 arc90 76.2,38.99 76.2,34.04 arc-90 75.18,33.02 57.28,33.02 arc-90 56.26,34.04 56.26,38.86 arc90 55.12,40.01 45.21,40.01 arc90 44.83,39.62 44.83,24.77 arc-90 43.56,23.5 19.18,23.5 arc90 17.91,22.23 17.91,8.13 arc-90 17.14,7.37 15.88,7.37 arc-90 15.11,8.13 15.11,24.38 arc90 14.35,25.15 arc-90 13.21,26.29 13.21,33.4 arc90 12.83,33.78 0,33.78 0,5.08 arc90
  pour Top (no thermals): 50.29,19.81 18.67,19.81 arc-90 17.91,20.57 17.91,22.23 arc-90 19.18,23.5 43.56,23.5 arc90 44.7,24.64 44.7,24.89 arc-90 45.59,25.78 55.12,25.78 arc-90 55.69,25.21
  pour Top (isolate 0.254, rank 3, no thermals): 16.38,15.49 arc90 15.67,14.78 15.67,7.54 arc-90 15.11,6.99 1.65,6.99 arc-90 0.89,7.75 0.89,24.51 arc-90 1.65,25.27 12.57,25.27 arc-90 13.21,24.64 13.21,23.5 arc90 13.84,22.86 15.88,22.86 arc-90 16.76,21.97 16.76,15.88 arc-90
GND1  (via drill 0.38)
  other vias: 60.58,2.67
IN_D_N
  Top 0.158: J1.A7 45.18,6.25 45.18,6.94 45.02,7.1 44.7,7.1 | 44.7,7.1 44.48,7.1 44.32,6.94 44.32,6.25 J1.B7 | U2.1 44.7,8.35 44.7,7.1
IN_D_P
  Top 0.158: J1.A6 44.75,5.54 44.9,5.39 45.52,5.39 45.68,5.55 45.68,6.18 J1.B6 45.75,6.89 46.42,7.55 U2.3
MCU_EN
  Top 0.381: U4.3 55.56,29.01 R5.2 54.51,29.07 C6.2
N$1
  Top 0.254: I1.13 9.62,20.6 R7.1 R10.1
N$4  (via drill 0.5)
  other vias: 21.08,21.08
N$8
  Top 0.254: U5.8 19.63,27.27
  Top 0.508: C12.2 C11.2 20.18,26.72 19.63,27.27
N$9
  Top 0.508: C3.1 57.71,3.08 U1.4
N$12
  Top 0.254: U3.3 11.69,16.51 10.27,15.1 I1.3
N$13
  Top 0.254: I1.6 12.22,12.8 R8.1 R11.1
N$14
  Top 0.254: U3.4 12.33,16.01 11.57,15.26 I1.5
N$15
  Top 0.254: R12.1 R9.1 9.26,12.19 9.62,12.55 I1.2
N$16
  Top 0.254: U3.2 11.31,17.01 10.27,18.05 I1.12
N$17
  Top 0.381: I1.9 I1.8
N$18
  Top 0.508: C11.1 R1.1
N$20
  Top 0.254: U5.10 22.09,28.58 C13.2
N$21
  Top 0.254: U5.5 18.03,27.34
  Top 0.381: R4.1 17.14,26.45 18.03,27.34
N$22
  pour Top (no thermals): 30.99,25.4 30.99,39.24 arc90 30.86,39.37 25.78,39.37 arc90 25.15,38.73 25.15,34.67 arc-90 24.13,33.66 22.86,33.66 arc90 22.23,33.02 arc-90 21.84,32.64 20.57,32.64 arc90 20.32,32.38 20.32,32.13 arc-90 19.81,31.62 19.18,31.62 arc90 18.92,31.37 18.92,29.97 19.68,29.97 arc-90 19.94,29.72 19.94,29.46 25.78,29.46 arc-90 26.29,28.96 26.29,25.4
N$23  (via drill 0.35)
  Top 0.254: R13.1 22.36,27.56 v21.34,27.56 20.57,27.56 20.27,27.86 U5.9 | R6.2 v25.27,28.96
  Bottom 0.254: v21.34,27.56 22.73,28.96 v25.27,28.96
N$26
  Top 0.254: 16.55,29.18 16.65,29.08 U5.2
  Top 0.508: C17.2 16.53,29.18 16.55,29.18
NOTHING
  pour Top: 14.86,2.03 14.86,2.92 arc-90 15.11,3.17 36.2,3.17 arc-90 36.32,3.05 36.32,1.14 arc-90 36.2,1.02 14.99,1.02 arc-90 14.86,1.14
NOTHING1
  pour Top: 2.67,37.85 2.67,38.48 arc-90 2.92,38.73 4.57,38.73 arc-90 4.7,38.61 4.7,37.85 arc-90 4.57,37.72 2.79,37.72 arc-90
NOTHING2
  pour Top: 85.48,2.32 85.48,2.96 arc-90 85.73,3.21 87.38,3.21 arc-90 87.51,3.09 87.51,2.32 arc-90 87.38,2.2 85.61,2.2 arc-90
USB_CC1  (via drill 0.4)
  Top 0.254: J1.A5 43.75,7.3 42.67,8.38 R2.2
  Top 0.305: R2.2 43.31,9.41 43.56,9.65 v43.56,13.84 | v47.37,13.84 49.91,13.84 51.56,12.19 61.09,12.19 61.72,12.83 U4.17
  Bottom 0.305: v43.56,13.84 v47.37,13.84
USB_CC2
  Top 0.152: J1.B5 46.75,7.38 46.98,7.61 46.98,7.99 R3.1
  Top 0.305: R3.1 47.62,9.41 47.37,9.65 47.37,11.94 48.01,12.57 50.16,12.57 51.18,11.56 61.98,11.56 62.99,12.57 U4.18
USB_D_N
  Top 0.158: U2.6 44.52,12.08 45.28,12.85 45.28,13.86 47.28,15.86 55.69,15.86 56.15,16.31 U4.13
USB_D_P
  Top 0.158: U2.4 46.42,12.08 45.65,12.85 45.65,13.71 47.43,15.49 55.75,15.49 56.21,15.04 U4.14
X_DRV_IN+
  Top 0.254: R7.2 8.39,20.72 8.97,20.13 I1.14 8.97,18.92 8.51,18.92 8.51,18.93 SV1.5
Y_DRV_IN+  (via drill 0.25)
  Top 0.254: R8.2 13.84,12.98 13.13,13.69 I1.7 12.87,15.03 v12.95,15.11 | v7.87,15.11 7.24,15.11 5.97,16.39 SV1.4
  Bottom 0.254: v12.95,15.11 v7.87,15.11
Z_DRV_IN+
  Top 0.254: R9.2 7.88,12.3 7.96,12.38 7.96,13.8 8,13.85 | SV1.3 8,13.85 | 8,13.85 8.97,13.85 I1.1

### Text on the board
tStop: R.F. | R.F. | Piezo nanopositioner signal generator V2 / HackerFab 2024
tDocu: +24V | +5V | GND | +3V3